# Altium schematic sheet Grabber_DIOT.SchDoc: =DocumentName
size A3; DocumentNumber: 1; Revision: 0; SheetNumber: 1; SheetTotal: 10; Last modified by: Krzysztof Belewicz
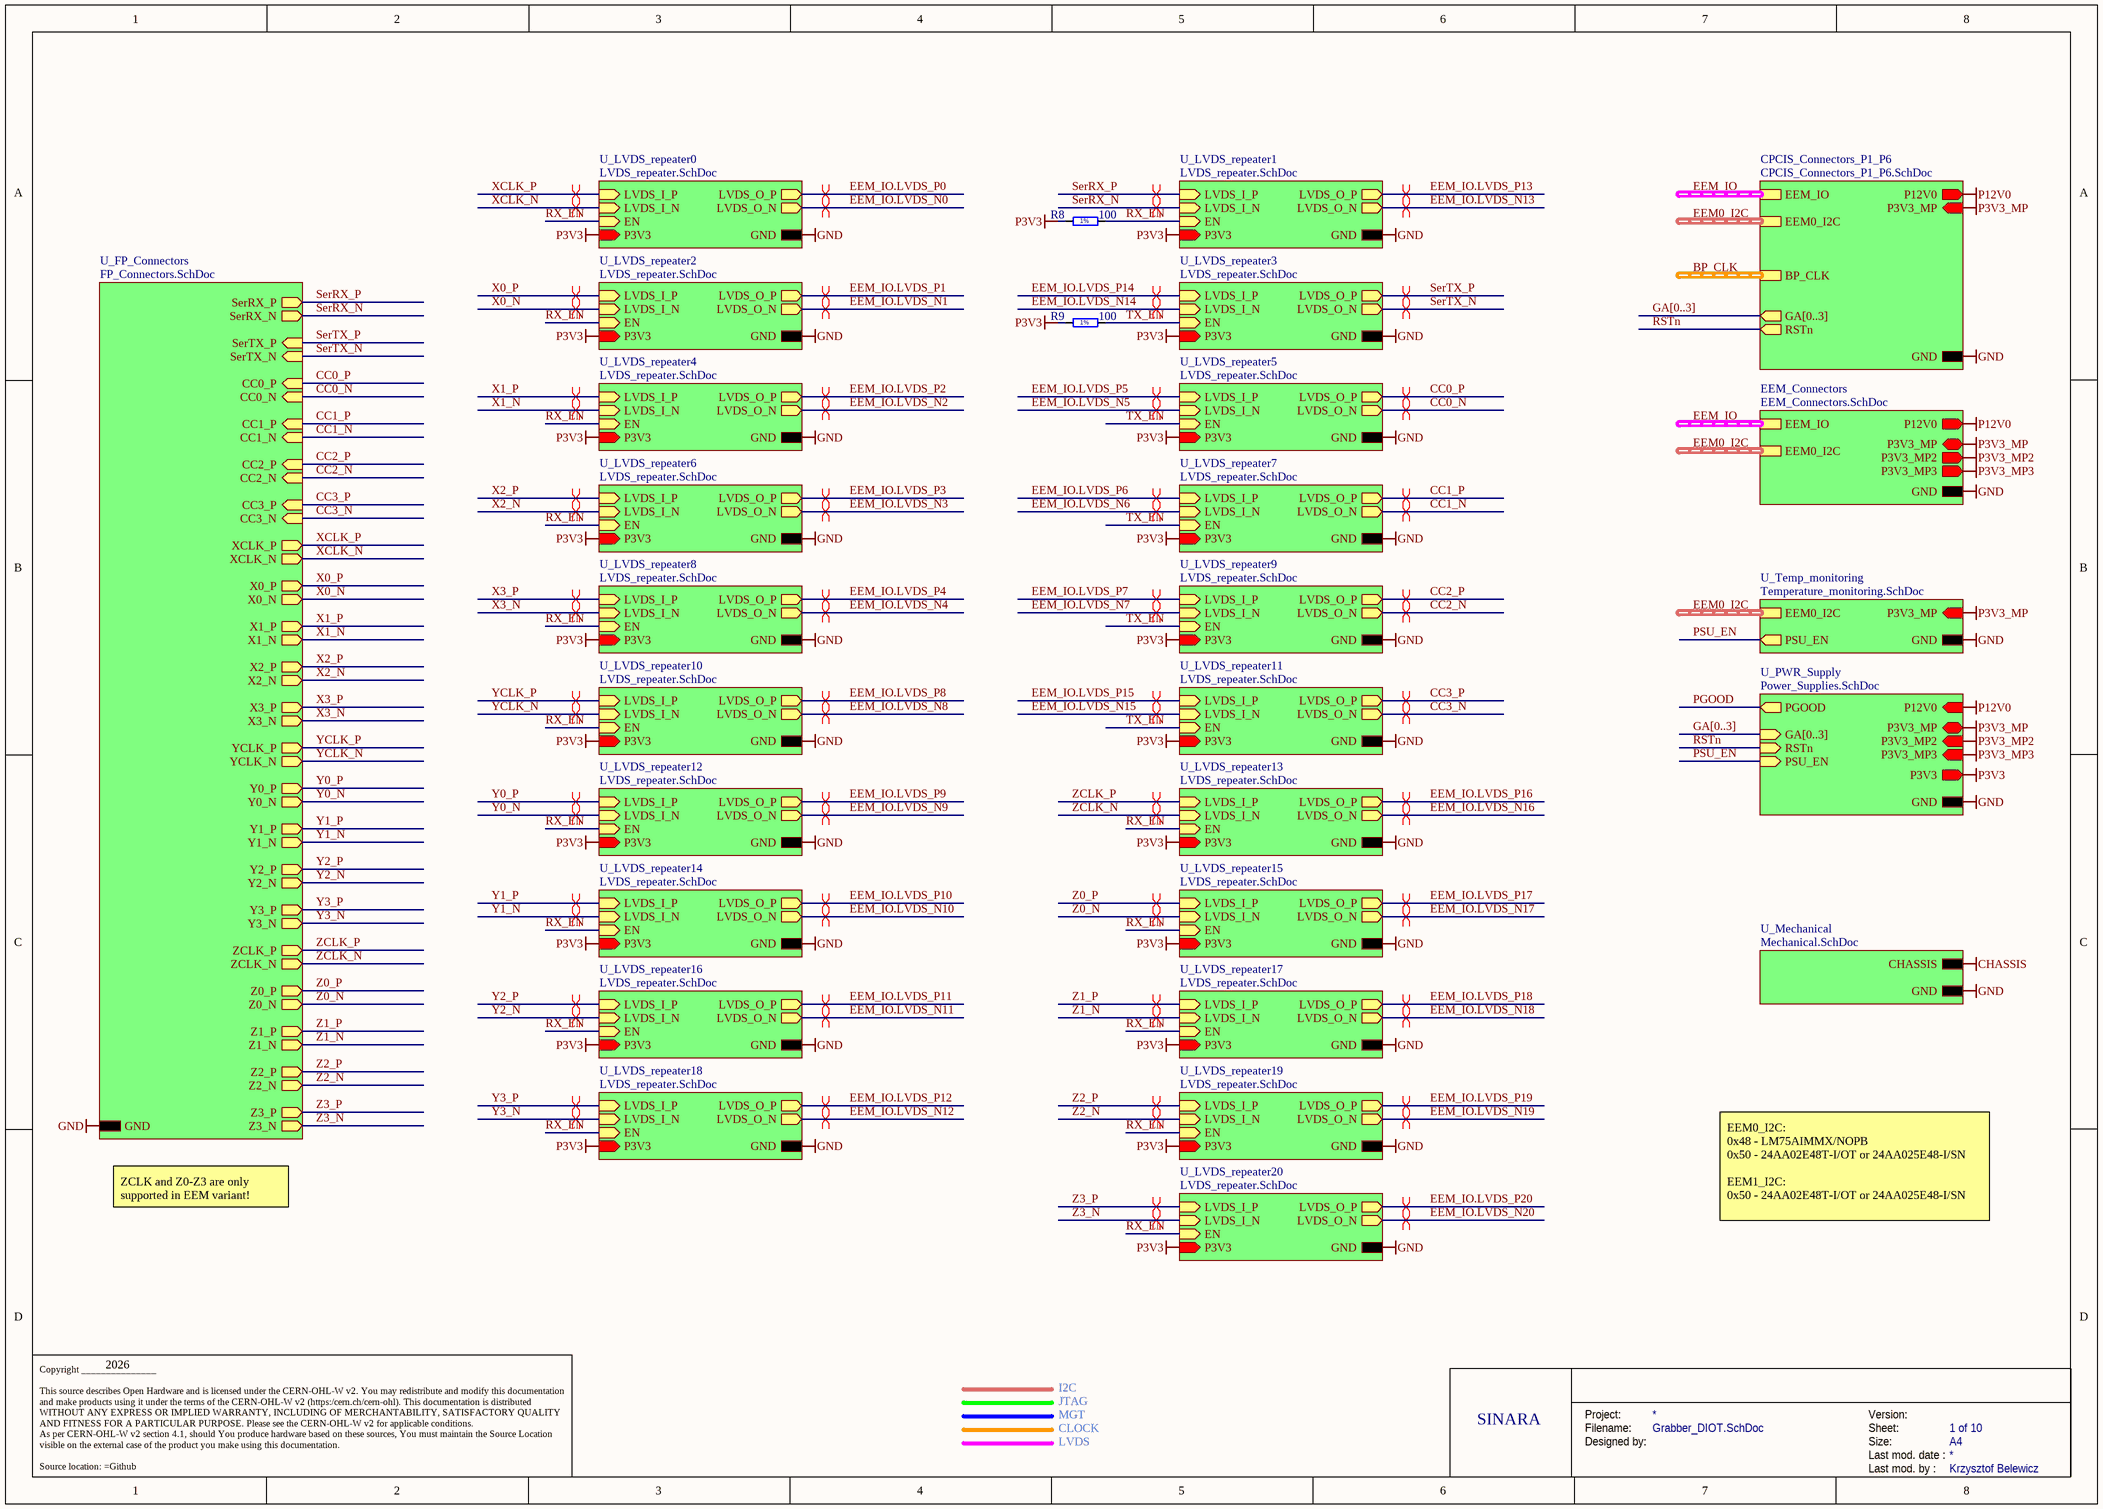
[diagram p0: Grabber_DIOT.SchDoc]

## Parts
R8  100  [RESC1005X40N]
R9  100  [RESC1005X40N]

## Sub-sheets
CPCIS_Connectors_P1_P6 = CPCIS_Connectors_P1_P6.SchDoc: P12V0 (out), P3V3_MP (in), EEM_IO (harness EEM_LVDS), EEM0_I2C (harness I2C), BP_CLK (harness CLK_DIFF), GA[0..3] (out), GND, RSTn (out)
EEM_Connectors = EEM_Connectors.SchDoc: P3V3_MP (bidir), P12V0 (out), EEM_IO (harness EEM_LVDS), EEM0_I2C (harness I2C), GND, P3V3_MP2 (out), P3V3_MP3 (out)
U_FP_Connectors = FP_Connectors.SchDoc: SerRX_P (out), SerRX_N (out), Z3_P (out), Z3_N (out), Z2_P (out), Z2_N (out), Z1_P (out), Z1_N (out), Z0_P (out), Z0_N (out), ZCLK_P (out), ZCLK_N (out), Y3_P (out), Y3_N (out), Y2_P (out), Y2_N (out), Y1_P (out), Y1_N (out), Y0_P (out), Y0_N (out), YCLK_P (out), YCLK_N (out), X3_P (out), X3_N (out), X2_P (out), X2_N (out), X1_P (out), X1_N (out), X0_P (out), X0_N (out), XCLK_P (out), XCLK_N (out), CC3_P (in), CC3_N (in), CC2_P (in), CC2_N (in), CC1_P (in), CC1_N (in), CC0_P (in), CC0_N (in), SerTX_P (in), SerTX_N (in), GND
U_LVDS_repeater0 = LVDS_repeater.SchDoc: LVDS_I_P (in), LVDS_I_N (in), LVDS_O_P (out), LVDS_O_N (out), EN (in), GND, P3V3 (in)
U_LVDS_repeater1 = LVDS_repeater.SchDoc: LVDS_I_P (in), LVDS_I_N (in), LVDS_O_P (out), LVDS_O_N (out), EN (in), GND, P3V3 (in)
U_LVDS_repeater2 = LVDS_repeater.SchDoc: LVDS_I_P (in), LVDS_I_N (in), LVDS_O_P (out), LVDS_O_N (out), EN (in), GND, P3V3 (in)
U_LVDS_repeater3 = LVDS_repeater.SchDoc: LVDS_I_P (in), LVDS_I_N (in), LVDS_O_P (out), LVDS_O_N (out), EN (in), GND, P3V3 (in)
U_LVDS_repeater4 = LVDS_repeater.SchDoc: LVDS_I_P (in), LVDS_I_N (in), LVDS_O_P (out), LVDS_O_N (out), EN (in), GND, P3V3 (in)
U_LVDS_repeater5 = LVDS_repeater.SchDoc: LVDS_I_P (in), LVDS_I_N (in), LVDS_O_P (out), LVDS_O_N (out), EN (in), GND, P3V3 (in)
U_LVDS_repeater6 = LVDS_repeater.SchDoc: LVDS_I_P (in), LVDS_I_N (in), LVDS_O_P (out), LVDS_O_N (out), EN (in), GND, P3V3 (in)
U_LVDS_repeater7 = LVDS_repeater.SchDoc: LVDS_I_P (in), LVDS_I_N (in), LVDS_O_P (out), LVDS_O_N (out), EN (in), GND, P3V3 (in)
U_LVDS_repeater8 = LVDS_repeater.SchDoc: LVDS_I_P (in), LVDS_I_N (in), LVDS_O_P (out), LVDS_O_N (out), EN (in), GND, P3V3 (in)
U_LVDS_repeater9 = LVDS_repeater.SchDoc: LVDS_I_P (in), LVDS_I_N (in), LVDS_O_P (out), LVDS_O_N (out), EN (in), GND, P3V3 (in)
U_LVDS_repeater10 = LVDS_repeater.SchDoc: LVDS_I_P (in), LVDS_I_N (in), LVDS_O_P (out), LVDS_O_N (out), EN (in), GND, P3V3 (in)
U_LVDS_repeater11 = LVDS_repeater.SchDoc: LVDS_I_P (in), LVDS_I_N (in), LVDS_O_P (out), LVDS_O_N (out), EN (in), GND, P3V3 (in)
U_LVDS_repeater12 = LVDS_repeater.SchDoc: LVDS_I_P (in), LVDS_I_N (in), LVDS_O_P (out), LVDS_O_N (out), EN (in), GND, P3V3 (in)
U_LVDS_repeater13 = LVDS_repeater.SchDoc: LVDS_I_P (in), LVDS_I_N (in), LVDS_O_P (out), LVDS_O_N (out), EN (in), GND, P3V3 (in)
U_LVDS_repeater14 = LVDS_repeater.SchDoc: LVDS_I_P (in), LVDS_I_N (in), LVDS_O_P (out), LVDS_O_N (out), EN (in), GND, P3V3 (in)
U_LVDS_repeater15 = LVDS_repeater.SchDoc: LVDS_I_P (in), LVDS_I_N (in), LVDS_O_P (out), LVDS_O_N (out), EN (in), GND, P3V3 (in)
U_LVDS_repeater16 = LVDS_repeater.SchDoc: LVDS_I_P (in), LVDS_I_N (in), LVDS_O_P (out), LVDS_O_N (out), EN (in), GND, P3V3 (in)
U_LVDS_repeater17 = LVDS_repeater.SchDoc: LVDS_I_P (in), LVDS_I_N (in), LVDS_O_P (out), LVDS_O_N (out), EN (in), GND, P3V3 (in)
U_LVDS_repeater18 = LVDS_repeater.SchDoc: LVDS_I_P (in), LVDS_I_N (in), LVDS_O_P (out), LVDS_O_N (out), EN (in), GND, P3V3 (in)
U_LVDS_repeater19 = LVDS_repeater.SchDoc: LVDS_I_P (in), LVDS_I_N (in), LVDS_O_P (out), LVDS_O_N (out), EN (in), GND, P3V3 (in)
U_LVDS_repeater20 = LVDS_repeater.SchDoc: LVDS_I_P (in), LVDS_I_N (in), LVDS_O_P (out), LVDS_O_N (out), EN (in), GND, P3V3 (in)
U_Mechanical = Mechanical.SchDoc: CHASSIS, GND
U_PWR_Supply = Power_Supplies.SchDoc: GND, P12V0 (in), P3V3 (out), P3V3_MP (bidir), PGOOD (out), GA[0..3] (in), RSTn (in), PSU_EN (in), P3V3_MP2 (in), P3V3_MP3 (in)
U_Temp_monitoring = Temperature_monitoring.SchDoc: GND, P3V3_MP (in), EEM0_I2C (harness I2C), PSU_EN (out)

## Nets
CHASSIS: sheet U_Mechanical/CHASSIS
GND: sheet U_PWR_Supply/GND, sheet CPCIS_Connectors_P1_P6/GND, sheet EEM_Connectors/GND, sheet U_Temp_monitoring/GND, sheet U_Mechanical/GND, sheet U_FP_Connectors/GND, sheet U_LVDS_repeater0/GND, sheet U_LVDS_repeater2/GND, sheet U_LVDS_repeater4/GND, sheet U_LVDS_repeater6/GND, sheet U_LVDS_repeater8/GND, sheet U_LVDS_repeater10/GND, sheet U_LVDS_repeater12/GND, sheet U_LVDS_repeater14/GND, sheet U_LVDS_repeater16/GND, sheet U_LVDS_repeater18/GND, sheet U_LVDS_repeater1/GND, sheet U_LVDS_repeater3/GND, sheet U_LVDS_repeater5/GND, sheet U_LVDS_repeater7/GND, sheet U_LVDS_repeater9/GND, sheet U_LVDS_repeater11/GND, sheet U_LVDS_repeater13/GND, sheet U_LVDS_repeater15/GND, sheet U_LVDS_repeater17/GND, sheet U_LVDS_repeater19/GND, sheet U_LVDS_repeater20/GND
P3V3: R8.1 R9.1 ; sheet U_PWR_Supply/P3V3, sheet U_LVDS_repeater0/P3V3, sheet U_LVDS_repeater2/P3V3, sheet U_LVDS_repeater4/P3V3, sheet U_LVDS_repeater6/P3V3, sheet U_LVDS_repeater8/P3V3, sheet U_LVDS_repeater10/P3V3, sheet U_LVDS_repeater12/P3V3, sheet U_LVDS_repeater14/P3V3, sheet U_LVDS_repeater16/P3V3, sheet U_LVDS_repeater18/P3V3, sheet U_LVDS_repeater1/P3V3, sheet U_LVDS_repeater3/P3V3, sheet U_LVDS_repeater5/P3V3, sheet U_LVDS_repeater7/P3V3, sheet U_LVDS_repeater9/P3V3, sheet U_LVDS_repeater11/P3V3, sheet U_LVDS_repeater13/P3V3, sheet U_LVDS_repeater15/P3V3, sheet U_LVDS_repeater17/P3V3, sheet U_LVDS_repeater19/P3V3, sheet U_LVDS_repeater20/P3V3
P3V3_MP: sheet U_PWR_Supply/P3V3_MP, sheet CPCIS_Connectors_P1_P6/P3V3_MP, sheet EEM_Connectors/P3V3_MP, sheet U_Temp_monitoring/P3V3_MP
P3V3_MP2: sheet U_PWR_Supply/P3V3_MP2, sheet EEM_Connectors/P3V3_MP2
P3V3_MP3: sheet U_PWR_Supply/P3V3_MP3, sheet EEM_Connectors/P3V3_MP3
P12V0: sheet U_PWR_Supply/P12V0, sheet CPCIS_Connectors_P1_P6/P12V0, sheet EEM_Connectors/P12V0
CC0_N: sheet U_FP_Connectors/CC0_N, sheet U_LVDS_repeater5/LVDS_O_N
CC0_P: sheet U_FP_Connectors/CC0_P, sheet U_LVDS_repeater5/LVDS_O_P
CC1_N: sheet U_FP_Connectors/CC1_N, sheet U_LVDS_repeater7/LVDS_O_N
CC1_P: sheet U_FP_Connectors/CC1_P, sheet U_LVDS_repeater7/LVDS_O_P
CC2_N: sheet U_FP_Connectors/CC2_N, sheet U_LVDS_repeater9/LVDS_O_N
CC2_P: sheet U_FP_Connectors/CC2_P, sheet U_LVDS_repeater9/LVDS_O_P
CC3_N: sheet U_FP_Connectors/CC3_N, sheet U_LVDS_repeater11/LVDS_O_N
CC3_P: sheet U_FP_Connectors/CC3_P, sheet U_LVDS_repeater11/LVDS_O_P
EEM_IO.LVDS_N0: sheet U_LVDS_repeater0/LVDS_O_N
EEM_IO.LVDS_N1: sheet U_LVDS_repeater2/LVDS_O_N
EEM_IO.LVDS_N2: sheet U_LVDS_repeater4/LVDS_O_N
EEM_IO.LVDS_N3: sheet U_LVDS_repeater6/LVDS_O_N
EEM_IO.LVDS_N4: sheet U_LVDS_repeater8/LVDS_O_N
EEM_IO.LVDS_N5: sheet U_LVDS_repeater5/LVDS_I_N
EEM_IO.LVDS_N6: sheet U_LVDS_repeater7/LVDS_I_N
EEM_IO.LVDS_N7: sheet U_LVDS_repeater9/LVDS_I_N
EEM_IO.LVDS_N8: sheet U_LVDS_repeater10/LVDS_O_N
EEM_IO.LVDS_N9: sheet U_LVDS_repeater12/LVDS_O_N
EEM_IO.LVDS_N10: sheet U_LVDS_repeater14/LVDS_O_N
EEM_IO.LVDS_N11: sheet U_LVDS_repeater16/LVDS_O_N
EEM_IO.LVDS_N12: sheet U_LVDS_repeater18/LVDS_O_N
EEM_IO.LVDS_N13: sheet U_LVDS_repeater1/LVDS_O_N
EEM_IO.LVDS_N14: sheet U_LVDS_repeater3/LVDS_I_N
EEM_IO.LVDS_N15: sheet U_LVDS_repeater11/LVDS_I_N
EEM_IO.LVDS_N16: sheet U_LVDS_repeater13/LVDS_O_N
EEM_IO.LVDS_N17: sheet U_LVDS_repeater15/LVDS_O_N
EEM_IO.LVDS_N18: sheet U_LVDS_repeater17/LVDS_O_N
EEM_IO.LVDS_N19: sheet U_LVDS_repeater19/LVDS_O_N
EEM_IO.LVDS_N20: sheet U_LVDS_repeater20/LVDS_O_N
EEM_IO.LVDS_P0: sheet U_LVDS_repeater0/LVDS_O_P
EEM_IO.LVDS_P1: sheet U_LVDS_repeater2/LVDS_O_P
EEM_IO.LVDS_P2: sheet U_LVDS_repeater4/LVDS_O_P
EEM_IO.LVDS_P3: sheet U_LVDS_repeater6/LVDS_O_P
EEM_IO.LVDS_P4: sheet U_LVDS_repeater8/LVDS_O_P
EEM_IO.LVDS_P5: sheet U_LVDS_repeater5/LVDS_I_P
EEM_IO.LVDS_P6: sheet U_LVDS_repeater7/LVDS_I_P
EEM_IO.LVDS_P7: sheet U_LVDS_repeater9/LVDS_I_P
EEM_IO.LVDS_P8: sheet U_LVDS_repeater10/LVDS_O_P
EEM_IO.LVDS_P9: sheet U_LVDS_repeater12/LVDS_O_P
EEM_IO.LVDS_P10: sheet U_LVDS_repeater14/LVDS_O_P
EEM_IO.LVDS_P11: sheet U_LVDS_repeater16/LVDS_O_P
EEM_IO.LVDS_P12: sheet U_LVDS_repeater18/LVDS_O_P
EEM_IO.LVDS_P13: sheet U_LVDS_repeater1/LVDS_O_P
EEM_IO.LVDS_P14: sheet U_LVDS_repeater3/LVDS_I_P
EEM_IO.LVDS_P15: sheet U_LVDS_repeater11/LVDS_I_P
EEM_IO.LVDS_P16: sheet U_LVDS_repeater13/LVDS_O_P
EEM_IO.LVDS_P17: sheet U_LVDS_repeater15/LVDS_O_P
EEM_IO.LVDS_P18: sheet U_LVDS_repeater17/LVDS_O_P
EEM_IO.LVDS_P19: sheet U_LVDS_repeater19/LVDS_O_P
EEM_IO.LVDS_P20: sheet U_LVDS_repeater20/LVDS_O_P
PGOOD: sheet U_PWR_Supply/PGOOD
PSU_EN: sheet U_PWR_Supply/PSU_EN, sheet U_Temp_monitoring/PSU_EN
RSTn: sheet U_PWR_Supply/RSTn, sheet CPCIS_Connectors_P1_P6/RSTn
RX_EN: R8.2 ; sheet U_LVDS_repeater0/EN, sheet U_LVDS_repeater2/EN, sheet U_LVDS_repeater4/EN, sheet U_LVDS_repeater6/EN, sheet U_LVDS_repeater8/EN, sheet U_LVDS_repeater10/EN, sheet U_LVDS_repeater12/EN, sheet U_LVDS_repeater14/EN, sheet U_LVDS_repeater16/EN, sheet U_LVDS_repeater18/EN, sheet U_LVDS_repeater1/EN, sheet U_LVDS_repeater13/EN, sheet U_LVDS_repeater15/EN, sheet U_LVDS_repeater17/EN, sheet U_LVDS_repeater19/EN, sheet U_LVDS_repeater20/EN
SerRX_N: sheet U_FP_Connectors/SerRX_N, sheet U_LVDS_repeater1/LVDS_I_N
SerRX_P: sheet U_FP_Connectors/SerRX_P, sheet U_LVDS_repeater1/LVDS_I_P
SerTX_N: sheet U_FP_Connectors/SerTX_N, sheet U_LVDS_repeater3/LVDS_O_N
SerTX_P: sheet U_FP_Connectors/SerTX_P, sheet U_LVDS_repeater3/LVDS_O_P
TX_EN: R9.2 ; sheet U_LVDS_repeater3/EN, sheet U_LVDS_repeater5/EN, sheet U_LVDS_repeater7/EN, sheet U_LVDS_repeater9/EN, sheet U_LVDS_repeater11/EN
X0_N: sheet U_FP_Connectors/X0_N, sheet U_LVDS_repeater2/LVDS_I_N
X0_P: sheet U_FP_Connectors/X0_P, sheet U_LVDS_repeater2/LVDS_I_P
X1_N: sheet U_FP_Connectors/X1_N, sheet U_LVDS_repeater4/LVDS_I_N
X1_P: sheet U_FP_Connectors/X1_P, sheet U_LVDS_repeater4/LVDS_I_P
X2_N: sheet U_FP_Connectors/X2_N, sheet U_LVDS_repeater6/LVDS_I_N
X2_P: sheet U_FP_Connectors/X2_P, sheet U_LVDS_repeater6/LVDS_I_P
X3_N: sheet U_FP_Connectors/X3_N, sheet U_LVDS_repeater8/LVDS_I_N
X3_P: sheet U_FP_Connectors/X3_P, sheet U_LVDS_repeater8/LVDS_I_P
XCLK_N: sheet U_FP_Connectors/XCLK_N, sheet U_LVDS_repeater0/LVDS_I_N
XCLK_P: sheet U_FP_Connectors/XCLK_P, sheet U_LVDS_repeater0/LVDS_I_P
Y0_N: sheet U_FP_Connectors/Y0_N, sheet U_LVDS_repeater12/LVDS_I_N
Y0_P: sheet U_FP_Connectors/Y0_P, sheet U_LVDS_repeater12/LVDS_I_P
Y1_N: sheet U_FP_Connectors/Y1_N, sheet U_LVDS_repeater14/LVDS_I_N
Y1_P: sheet U_FP_Connectors/Y1_P, sheet U_LVDS_repeater14/LVDS_I_P
Y2_N: sheet U_FP_Connectors/Y2_N, sheet U_LVDS_repeater16/LVDS_I_N
Y2_P: sheet U_FP_Connectors/Y2_P, sheet U_LVDS_repeater16/LVDS_I_P
Y3_N: sheet U_FP_Connectors/Y3_N, sheet U_LVDS_repeater18/LVDS_I_N
Y3_P: sheet U_FP_Connectors/Y3_P, sheet U_LVDS_repeater18/LVDS_I_P
YCLK_N: sheet U_FP_Connectors/YCLK_N, sheet U_LVDS_repeater10/LVDS_I_N
YCLK_P: sheet U_FP_Connectors/YCLK_P, sheet U_LVDS_repeater10/LVDS_I_P
Z0_N: sheet U_FP_Connectors/Z0_N, sheet U_LVDS_repeater15/LVDS_I_N
Z0_P: sheet U_FP_Connectors/Z0_P, sheet U_LVDS_repeater15/LVDS_I_P
Z1_N: sheet U_FP_Connectors/Z1_N, sheet U_LVDS_repeater17/LVDS_I_N
Z1_P: sheet U_FP_Connectors/Z1_P, sheet U_LVDS_repeater17/LVDS_I_P
Z2_N: sheet U_FP_Connectors/Z2_N, sheet U_LVDS_repeater19/LVDS_I_N
Z2_P: sheet U_FP_Connectors/Z2_P, sheet U_LVDS_repeater19/LVDS_I_P
Z3_N: sheet U_FP_Connectors/Z3_N, sheet U_LVDS_repeater20/LVDS_I_N
Z3_P: sheet U_FP_Connectors/Z3_P, sheet U_LVDS_repeater20/LVDS_I_P
ZCLK_N: sheet U_FP_Connectors/ZCLK_N, sheet U_LVDS_repeater13/LVDS_I_N
ZCLK_P: sheet U_FP_Connectors/ZCLK_P, sheet U_LVDS_repeater13/LVDS_I_P

## Buses and harness runs
bus GA[0..3] = sheet CPCIS_Connectors_P1_P6/GA[0..3]
bus GA[0..3] = sheet U_PWR_Supply/GA[0..3]
harness BP_CLK = sheet CPCIS_Connectors_P1_P6/BP_CLK
harness EEM0_I2C = sheet CPCIS_Connectors_P1_P6/EEM0_I2C
harness EEM0_I2C = sheet EEM_Connectors/EEM0_I2C
harness EEM0_I2C = sheet U_Temp_monitoring/EEM0_I2C
harness EEM_IO = sheet CPCIS_Connectors_P1_P6/EEM_IO
harness EEM_IO = sheet EEM_Connectors/EEM_IO

## Layout directives
differential pair: CC0_N, CC0_P, CC1_N, CC1_P, CC2_N, CC2_P, CC3_N, CC3_P, EEM_IO.LVDS_N0, EEM_IO.LVDS_N1, EEM_IO.LVDS_N2, EEM_IO.LVDS_N3, EEM_IO.LVDS_N4, EEM_IO.LVDS_N5, EEM_IO.LVDS_N6, EEM_IO.LVDS_N7, EEM_IO.LVDS_N8, EEM_IO.LVDS_N9, EEM_IO.LVDS_N10, EEM_IO.LVDS_N11, EEM_IO.LVDS_N12, EEM_IO.LVDS_N13, EEM_IO.LVDS_N14, EEM_IO.LVDS_N15, EEM_IO.LVDS_N16, EEM_IO.LVDS_N17, EEM_IO.LVDS_N18, EEM_IO.LVDS_N19, EEM_IO.LVDS_N20, EEM_IO.LVDS_P0, EEM_IO.LVDS_P1, EEM_IO.LVDS_P2, EEM_IO.LVDS_P3, EEM_IO.LVDS_P4, EEM_IO.LVDS_P5, EEM_IO.LVDS_P6, EEM_IO.LVDS_P7, EEM_IO.LVDS_P8, EEM_IO.LVDS_P9, EEM_IO.LVDS_P10, EEM_IO.LVDS_P11, EEM_IO.LVDS_P12, EEM_IO.LVDS_P13, EEM_IO.LVDS_P14, EEM_IO.LVDS_P15, EEM_IO.LVDS_P16, EEM_IO.LVDS_P17, EEM_IO.LVDS_P18, EEM_IO.LVDS_P19, EEM_IO.LVDS_P20, SerRX_N, SerRX_P, SerTX_N, SerTX_P, X0_N, X0_P, X1_N, X1_P, X2_N, X2_P, X3_N, X3_P, XCLK_N, XCLK_P, Y0_N, Y0_P, Y1_N, Y1_P, Y2_N, Y2_P, Y3_N, Y3_P, YCLK_N, YCLK_P, Z0_N, Z0_P, Z1_N, Z1_P, Z2_N, Z2_P, Z3_N, Z3_P, ZCLK_N, ZCLK_P

## Notes on the sheet
- ZCLK and Z0-Z3 are only supported in EEM variant!
- EEM0_I2C:
  0x48 - LM75AIMMX/NOPB
  0x50 - 24AA02E48T-I/OT or 24AA025E48-I/SN
  EEM1_I2C:
  0x50 - 24AA02E48T-I/OT or 24AA025E48-I/SN
- 2026
- I2C
- JTAG
- MGT
- CLOCK
- LVDS
- SINARA
- Project:
- Designed by:
- Filename:
- Size:
- Version:
- Last mod. date :
- Sheet:
- A4
- Copyright _______________
  This source describes Open Hardware and is licensed under the CERN-OHL-W v2. You may redistribute and modify this documentation and make products using it under the terms of the CERN-OHL-W v2 (https:/cern.ch/cern-ohl). This documentation is distributed WITHOUT ANY EXPRESS OR IMPLIED WARRANTY, INCLUDING OF MERCHANTABILITY, SATISFACTORY QUALITY AND FITNESS FOR A PARTICULAR PURPOSE. Please see the CERN-OHL-W v2 for applicable conditions.
  As per CERN-OHL-W v2 section 4.1, should You produce hardware based on these sources, You must maintain the Source Location visible on the external case of the product you make using this documentation.
  Source location: =Github
- Last mod. by :
- (in symbol R0402_100R_1%_0.1W_100PPM) 1%

## Library data of the parts
R8 R9 = R0402_100R_1%_0.1W_100PPM: Resistor - 1%; Part Description: General Purpose Thick Film Chip Resistor; Manufacturer: GENERIC; Manufacturer Part Number: R0402_100R_1%_0.1W_100PPM_50V; Manufacturer1 Part Number: ERJ2RKF1000X; Power: 0.1W; TC: ±100ppm/°C; Voltage: 50V; Part Number: R0402_100R_1%_0.1W_100PPM; Component Kind: Standard; Component Type: Standard; Pin Count: 2; Value: 100; Status: Not recommended; Tolerance: ±1%; Case: 0402; Mounted: Yes; Sense: No; Socket: No; SMD: Yes; Manufacturer1 Example: PANASONIC; Manufacturer1 ComponentHeight: 0.4mm; HelpURL: \\cern.ch\dfs\Applications\Altium\Datasheets\R0402_PANASONIC_ERJ2RK.pdf; Author: CERN DEM JLC; CreateDate: 12.12.2013; LatestRevisionDate: 03.03.2015